# Altium schematic sheet A-02 BLOCK DIAGRAM.SchDoc
size 513 x 386 mm; Address1: 350W 9th Ave; Address2: Suite 206; Address3: Escondido CA 92025; Address4: United States; Revision: -; ENG_APP_DATE: --/--/--; DSN_APP_DATE: --/--/--; CHK_APP_DATE: --/--/--
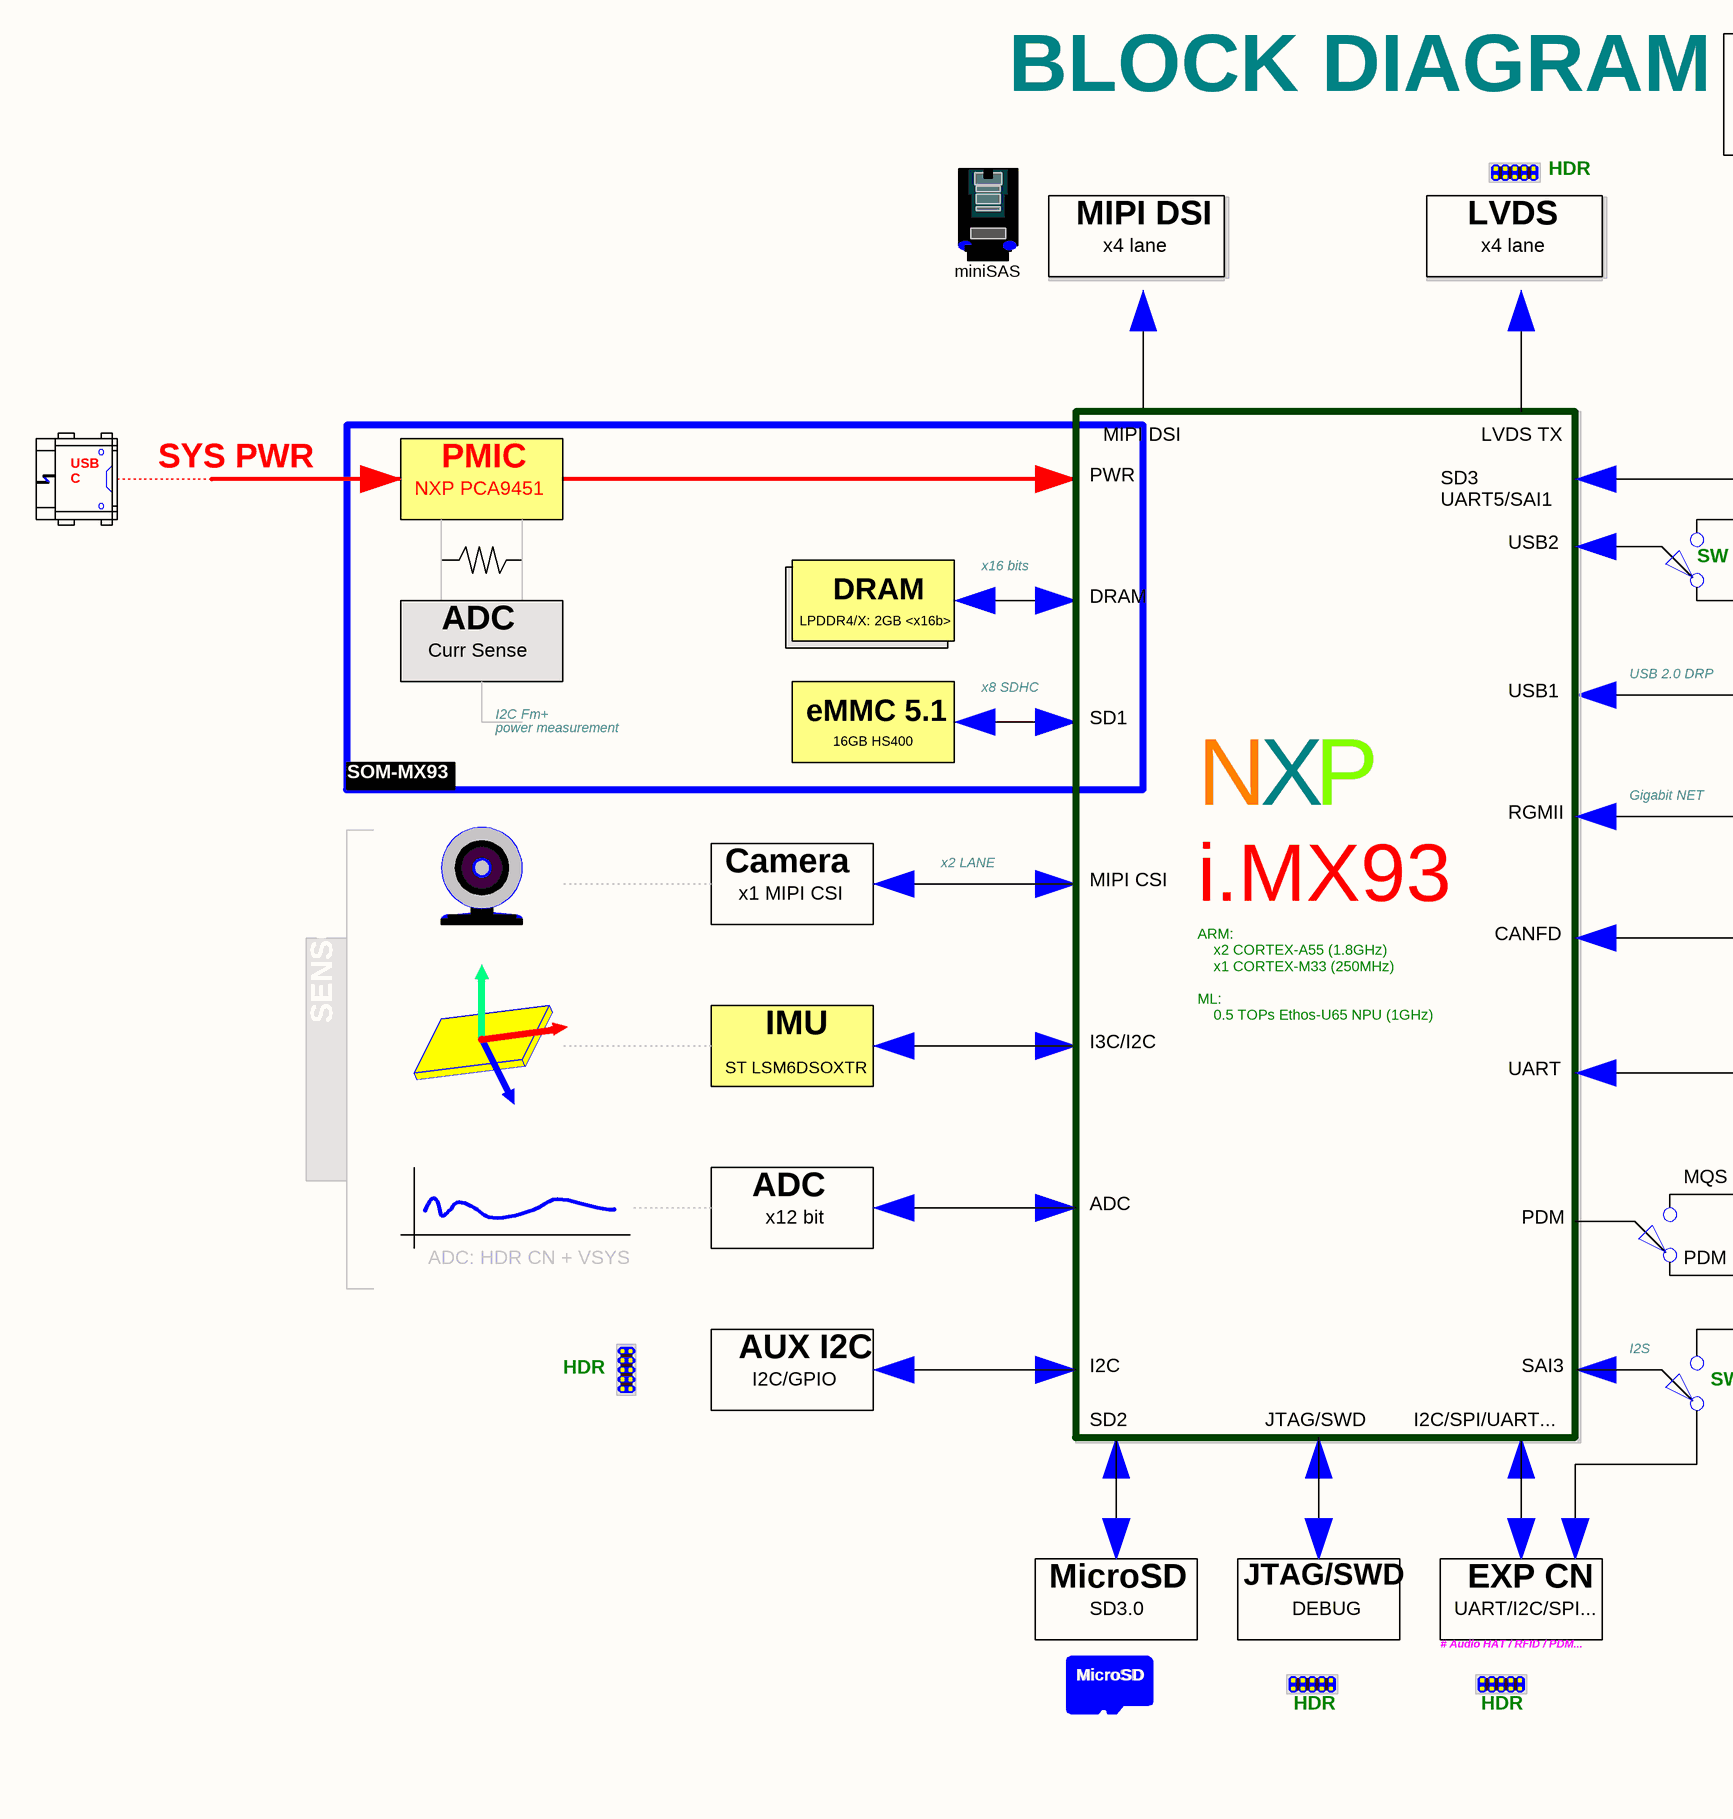
[diagram p0: A-02 BLOCK DIAGRAM.SchDoc, left]
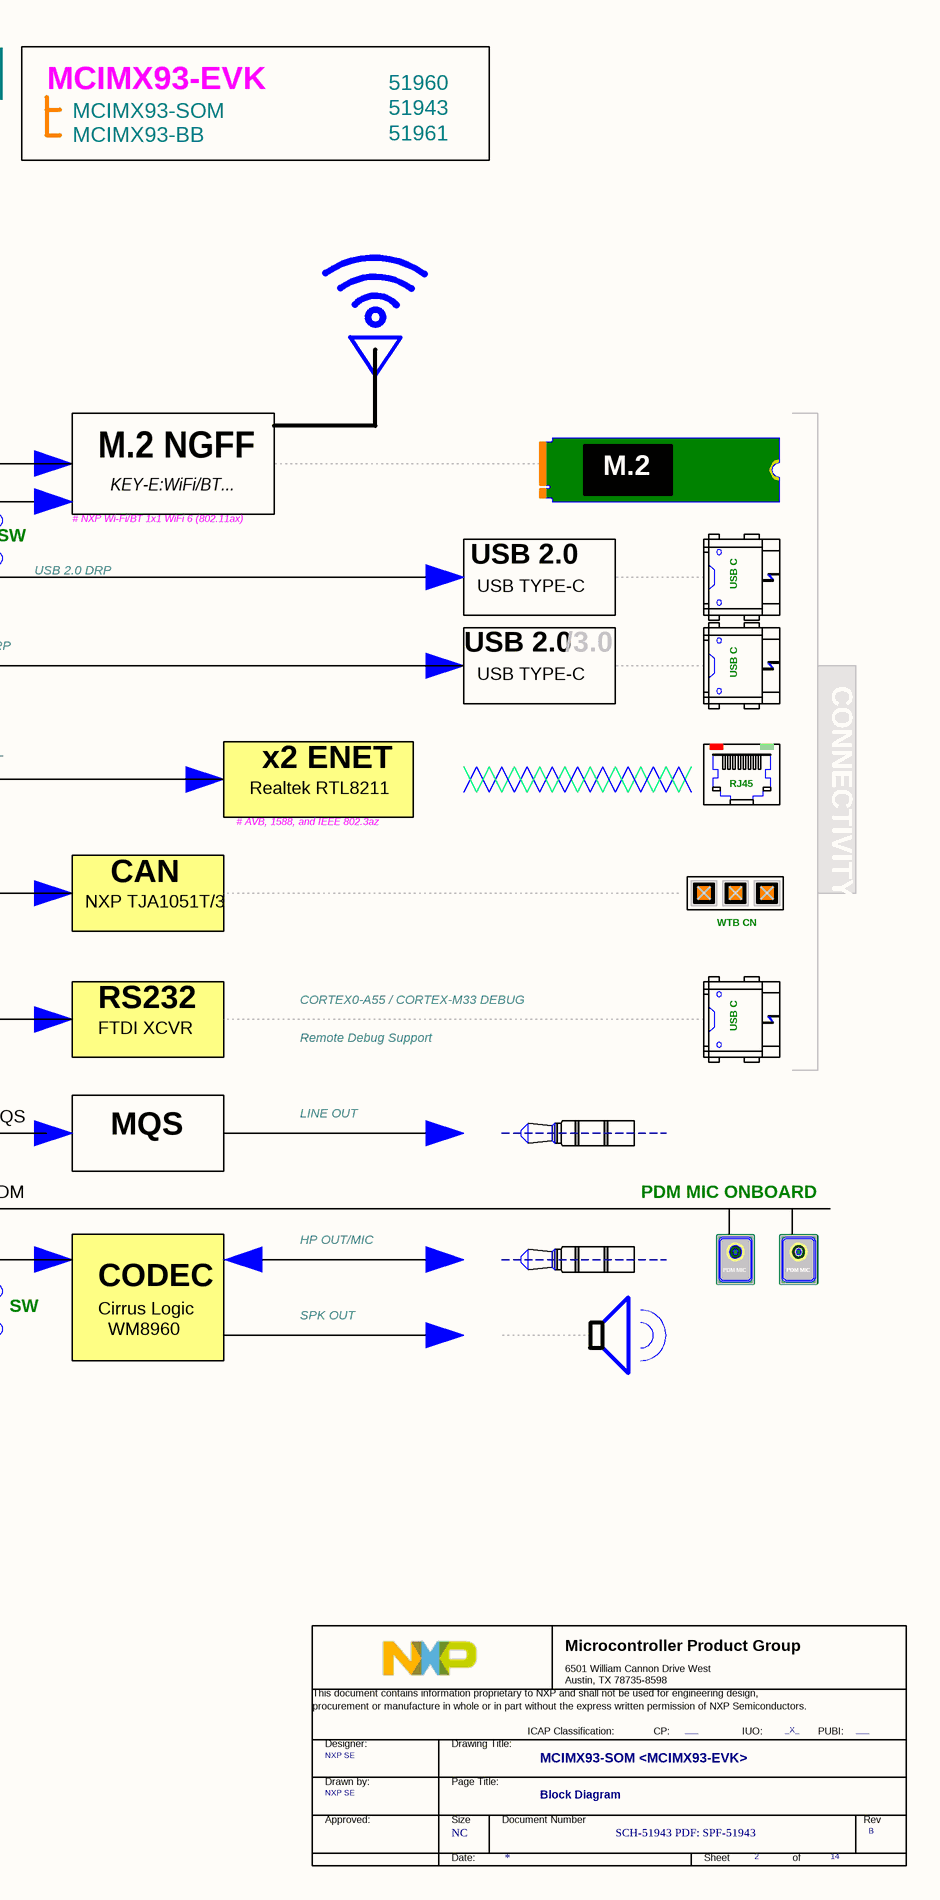
[diagram p1: A-02 BLOCK DIAGRAM.SchDoc, right]

## Parts
*  Doc: SCH-51943 PDF: SPF-51943  RevCode: B  Title: MCIMX93-SOM <MCIMX93-EVK>  Page Size: NC  Page Number: 2  Page Count: 14  PageTitle: Block Diagram  Designer: NXP SE  PUBI: ___  FIUO: _X_  (hidden comment: TitleBlock_MCPG)  (graphical)

## Notes on the sheet
- BLOCK DIAGRAM
- MCIMX93-EVK
- 51943
- 51960
- HDR
- MCIMX93-SOM
  MCIMX93-BB
- 51961
- MIPI DSI
- x4 lane
- LVDS
- miniSAS
- LVDS TX
- USB C
  PD
- SYS PWR
- NXP PCA9451
- PMIC
- PWR
- SD3
  UART5/SAI1
- M.2 NGFF
- KEY-E:WiFi/BT...
- M.2
- x16 bits
- USB2
- SW
- USB 2.0 DRP
- # NXP Wi-Fi/BT 1x1 WiFi 6 (802.11ax)
- USB 2.0
- Curr Sense
- ADC
- LPDDR4/X: 2GB <x16b>
- DRAM
- USB TYPE-C
- USB C
- I2C Fm+
- power measurement
- eMMC 5.1
- x8 SDHC
- SD1
- USB1
- /3.0
- CONNECTIVITY
- SOM-MX93
- 16GB HS400
- Gigabit NET
- x2 LANE
- N
- X
- P
- RGMII
- # AVB, 1588, and IEEE 802.3az
- Realtek RTL8211
- x2 ENET
- RJ45
- Camera
- x1 MIPI CSI
- MIPI CSI
- i.MX93
- CAN
- CANFD
- NXP TJA1051T/3
- WTB CN
- SENSOR
- ST LSM6DSOXTR
- IMU
- I3C/I2C
- ARM:
  x2 CORTEX-A55 (1.8GHz)
  x1 CORTEX-M33 (250MHz)
  ML:
  0.5 TOPs Ethos-U65 NPU (1GHz)
- RS232
- CORTEX0-A55 / CORTEX-M33 DEBUG
- UART
- FTDI XCVR
- Remote Debug Support
- MQS
- LINE OUT
- ADC: HDR CN + VSYS
- x12 bit
- PDM
- PDM MIC ONBOARD
- HP OUT/MIC
- PDM MIC
- AUX I2C
- I2C/GPIO
- I2C
- SAI3
- I2S
- Cirrus Logic
  WM8960
- CODEC
- SPK OUT
- SD2
- JTAG/SWD
- I2C/SPI/UART...
- MicroSD
- EXP CN
- SD3.0
- DEBUG
- # Audio HAT / RFID / PDM...
- UART/I2C/SPI...
- 8
- 7
- 6
- 5
- 4
- 3
- 2
- 1
- REVISION
- DESCRIPTION
- DATE
- APPROVED
- F
- E
- D
- C
- B
- PROJECT:
- REV.
- ENG:
- APPROVALS
- PROJECT
- JordanDSP LLC <https://www.jordandsp.com>
- Envision Excellence
- SHT.
- A
- DSN:
- CHK:
- REFERENCE ITEMS
- PRJ VCS REVISION:
- TITLE
- DOC VCS REVISION:
- MODIFIED DATE:
- BOM:
- FAB DWG:
- FIRMWARE:
- ASSY DWG:
- SCALE:
- SIZE
- CAGE CODE
- FILE NAME
- DWG NO.
- PAGE
- PRODUCT REV
- OF
- (in symbol TitleBlock_MCPG) Microcontroller Product Group; 6501 William Cannon Drive West / Austin, TX 78735-8598; This document contains information proprietary to NXP and shall not be used for engineering design,; procurement or manufacture in whole or in part without the express written permission of NXP Semiconductors.; ICAP Classification:; CP:; IUO:; PUBI:; Designer:; Drawing Title:; Drawn by:; Page Title:; Approved:; Size; Document Number; Rev; Date:; Sheet; of

## Library data of the parts
* = TitleBlock_MCPG: OrgAddr1: NO. 192 Liangjing Rd. Pudong New Area, ShangHai; OrgName: NXP Semiconductor; Page Create Date: March  8, 1995; DrawnBy: NXP SE; FCP: ___; Page Modify Date: *